# Altium schematic sheet Fan_Block.SchDoc
size A4; CheckedBy: CT-Energys; Author: CT-Energys; CompanyName: HTD COMPANY LIMITED; DrawnBy: CHITOAN; Engineer: CHITOAN; Organization: Altium Limited; Address1: HO CHI MINH CITY; Address2: VIETNAM
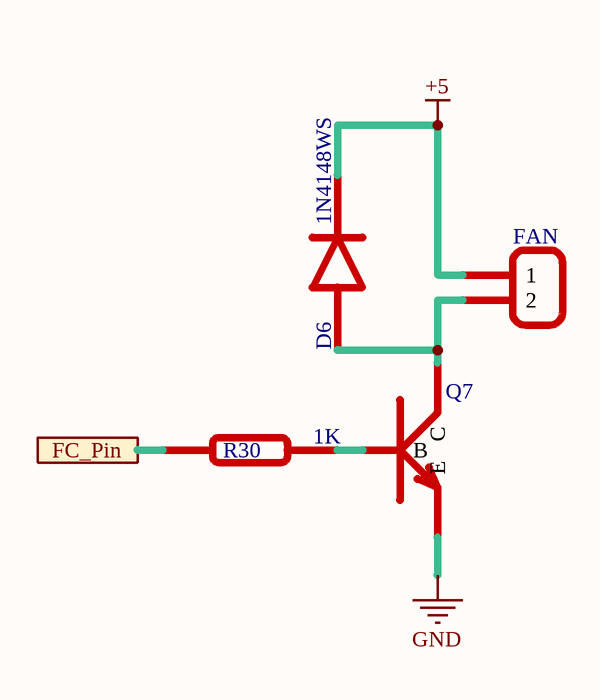
[diagram p0: Fan_Block.SchDoc]

## Parts
D6  1N4148WS  [SMA]
H4  FAN  [XH-2.54-2P]
Q7  S8050  [SOT-23]  (value not drawn)
R30  1K  [R0603]

## Ports
FC_Pin

## Nets
+5: D6.K H4.1
GND: Q7.2(E)
FC_Pin: R30.1 ; port FC_Pin
NetD6_A: D6.A H4.2 Q7.3(C)
NetQ7_1: Q7.1(B) R30.2

## Notes on the sheet
- Title
- Size:
- Date:
- A4
- Number:
- Time:
- Revision:
- Design by:
- Company:
- File:

## Library data of the parts
D6 = 1N4148WS: Small Signal Diode
H4 = CONN-2P: Connector 2 Pole
Q7 = S8050: NPN Transistors 0.5A Collector to Emitter 25V
R30 = Resistor